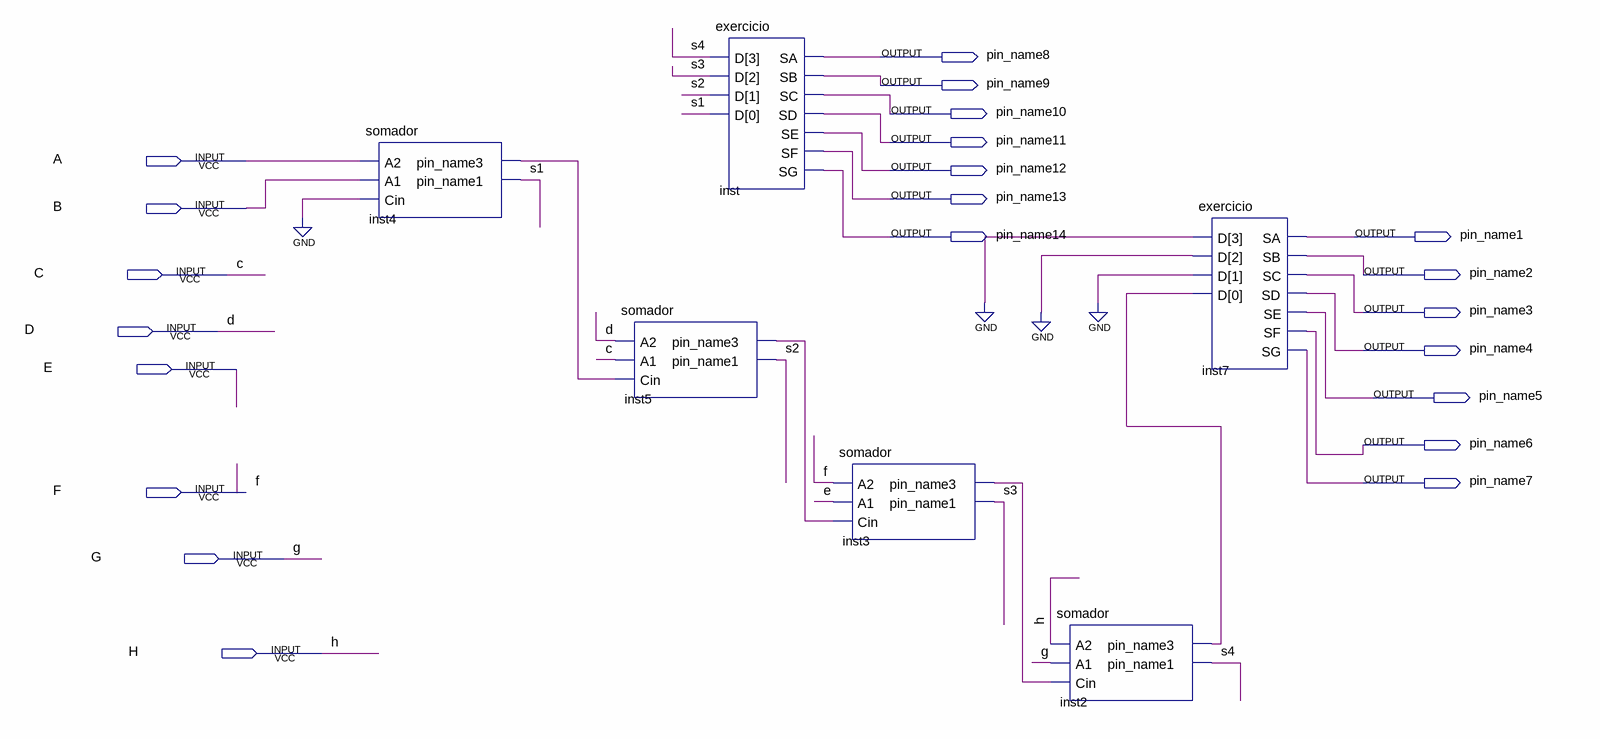
[diagram p0: schematic sheet]
// Quartus schematic somadorpala.bdf as structural Verilog: 6 symbols, 22 pins
module somadorpala (
  input  A,
  input  B,
  input  C,
  input  D,
  input  E,
  input  F,
  input  G,
  input  H,
  output pin_name8,
  output pin_name9,
  output pin_name10,
  output pin_name11,
  output pin_name12,
  output pin_name13,
  output pin_name14,
  output pin_name1,
  output pin_name2,
  output pin_name3,
  output pin_name4,
  output pin_name5,
  output pin_name6,
  output pin_name7
);

  wire inst2_pin_name3, inst3_pin_name3, inst4_pin_name3, inst5_pin_name3, s1, s2, s3, s4;

  somador inst4 (.A2(A), .A1(B), .Cin(1'b0), .pin_name3(inst4_pin_name3), .pin_name1(s1));
  somador inst5 (.A2(D), .A1(C), .Cin(inst4_pin_name3), .pin_name3(inst5_pin_name3), .pin_name1(s2));
  exercicio inst (
    .D({s4, s3, s2, s1}), .SA(pin_name8), .SB(pin_name9), .SC(pin_name10), .SD(pin_name11), .SE(pin_name12),
    .SF(pin_name13), .SG(pin_name14));
  somador inst3 (.A2(F), .A1(E), .Cin(inst5_pin_name3), .pin_name3(inst3_pin_name3), .pin_name1(s3));
  somador inst2 (.A2(H), .A1(G), .Cin(inst3_pin_name3), .pin_name3(inst2_pin_name3), .pin_name1(s4));
  exercicio inst7 (
    .D({3'b000, inst2_pin_name3}), .SA(pin_name1), .SB(pin_name2), .SC(pin_name3), .SD(pin_name4),
    .SE(pin_name5), .SF(pin_name6), .SG(pin_name7));
endmodule
